# Altium schematic sheet STlink-plug.SchDoc
size A; SheetNumber: 3; SheetTotal: 7
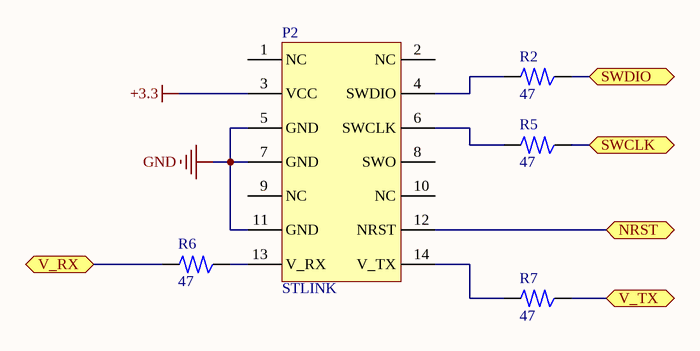
[diagram p0: STlink-plug.SchDoc]

## Parts
P2  STLINK  [SMT_CON_SAMTEC_FTSH-107-01-L-DV-K]
R2  47  [SMT_RES_0805(2012)]
R5  47  [SMT_RES_0805(2012)]
R6  47  [SMT_RES_0805(2012)]
R7  47  [SMT_RES_0805(2012)]

## Ports
NRST (bidir), SWCLK (bidir), SWDIO (bidir), V_RX (bidir), V_TX (bidir)

## Nets
+3.3: P2.3(VCC)
GND: P2.5(GND) P2.7(GND) P2.11(GND)
NRST: P2.12(NRST) ; port NRST
SWCLK: R5.2 ; port SWCLK
SWDIO: R2.2 ; port SWDIO
V_RX: R6.1 ; port V_RX
V_TX: R7.2 ; port V_TX
NetP2_4: P2.4(SWDIO) R2.1
NetP2_6: P2.6(SWCLK) R5.1
NetP2_13: P2.13(V_RX) R6.2
NetP2_14: P2.14(V_TX) R7.1

Not connected (* = marked no-connect by the designer): P2 1(NC) 2(NC) 8(SWO) 9(NC) 10(NC)

## Library data of the parts
P2 = SMT_CON_SAMTEC_FTSH-107-01-L-DV-K: Connector 14-pin Samtec FTSH-107-01-L-DV-K 1.27mm Pitch SMT
R2 R5-R7 = SMT_RES_0805(2012): 0805(2012) Resistor 1/4-1/8W 150V 2A